# Altium project AccessControl.PrjPcb (part 2 of 2)

## Sheet UART_RS485.SchDoc: Access Control
size A; DrawnBy: Q.Thang & T.Khoa; Revision: V1.0.1; SheetNumber: 12; SheetTotal: 16
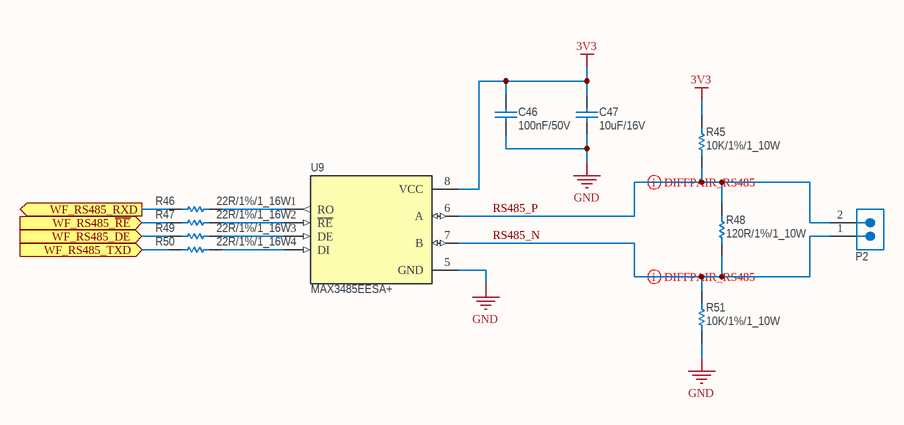
[diagram p7: UART_RS485.SchDoc]

### Parts
C46  100nF/50V  [CAP_0603]
C47  10uF/16V  [CAP_0603]
P2  3.81mm_2P  [Terminal_Block_3.81mm_2P]  (value not drawn)
R45  10K/1%/1_10W  [Resistor_0603]
R46  22R/1%/1_16W  [RESISTOR_0402]
R47  22R/1%/1_16W  [RESISTOR_0402]
R48  120R/1%/1_10W  [Resistor_0603]
R49  22R/1%/1_16W  [RESISTOR_0402]
R50  22R/1%/1_16W  [RESISTOR_0402]
R51  10K/1%/1_10W  [Resistor_0603]
U9  MAX3485EESA+  [SOIC-8]

### Ports
WF_RS485_DE (in, see Overview_Schematic[6B], ESP32_WiFi[3B]), WF_RS485_RXD (out, see Overview_Schematic[6B], ESP32_WiFi[3A]), WF_RS485_TXD (in, see Overview_Schematic[6B], ESP32_WiFi[3A]), WF_RS485_~{RE} (in, see Overview_Schematic[6B], ESP32_WiFi[3B])

### Nets
3V3: C46.2 C47.2 R45.2 U9.8(VCC)
GND: C46.1 C47.1 R51.2 U9.5(GND)
RS485_N: P2.1 R48.1 R51.1 U9.7(B)
RS485_P: P2.2 R45.1 R48.2 U9.6(A)
NetR46_1: R46.1 ; port WF_RS485_RXD
NetR46_2: R46.2 U9.1(RO)
NetR47_1: R47.1 ; port WF_RS485_~{RE}
NetR47_2: R47.2 U9.2(~{RE})
NetR49_1: R49.1 ; port WF_RS485_DE
NetR49_2: R49.2 U9.3(DE)
NetR50_1: R50.1 ; port WF_RS485_TXD
NetR50_2: R50.2 U9.4(DI)

### Layout directives
differential pair: RS485_N, RS485_P

### Notes on the sheet
- Project Name
- Size
- A4
- Revision
- Checked By:
- Drawn By:
- Date:
- File:
- Last Modified:
- Sheet
- of

### Library data of the parts
C46 = Ceramic_Cap_100nF_50V_0603: as C1 on sheet Power_Supply; Datasheet: *; Supply URL: https://www.thegioiic.com/tu-gom-0603-100nf-0-1uf-50v
C47 = Ceramic_Cap_10uF_16V_0603: as C83 on sheet DAC_ADC_External; Datasheet: *; Supply URL: https://www.thegioiic.com/tu-gom-0603-10uf-16v
P2 = Terminal_Block_3.81mm_2P: Terminal Block THT, pitch 3.81mm, 2p, 300V, 10A; Supply Part Number: UL-3.81-2-R Terminal Block Plug-in Hàn PCB 2 Chân Cong 3.81mm 300V 10A ULO; Supply Name: Thegioiic; Supply URL: https://www.thegioiic.com/ul-3-81-2-r-terminal-block-plug-in-han-pcb-2-chan-cong-3-81mm-300v-10a-ulo
R45 R51 = Res_10K_0603_1%: as R17 on sheet ESP32_BLE; Supply URL: https://www.thegioiic.com/dien-tro-10-kohm-0603-1-
R46 R47 R49 R50 = Res_22R_0402_1%: Resistor 0402 22 Ohm 1% 1_16W; Supply Name: *; Supply Part Number: *; Supply URL: *
R48 = Res_120R_0603_1%: Resistor 0603 120 Ohm 1% 1_10W; Supply Part Number: Điện Trở 120 Ohm 0603 1%; Supply Name: Thegioiic; Supply URL: https://www.thegioiic.com/dien-tro-120-ohm-0603-1-
U9 = MAX3485EESA+: 1/1 Transceiver Half RS422, RS485 8-SOIC; Supply Part Number: MAX3485EESA+ Line Transceiver, 8-SOIC; Supply Name: Thegioiic; Datasheet: https://www.analog.com/media/en/technical-documentation/data-sheets/max3483e-max3491e.pdf; Supply URL: https://www.thegioiic.com/max3485eesa-line-transceiver-8-soic

## Sheet Camera.SchDoc: Access Control
size A; DrawnBy: Q.Thang & T.Khoa; Revision: V1.0.1; SheetNumber: 9; SheetTotal: 16
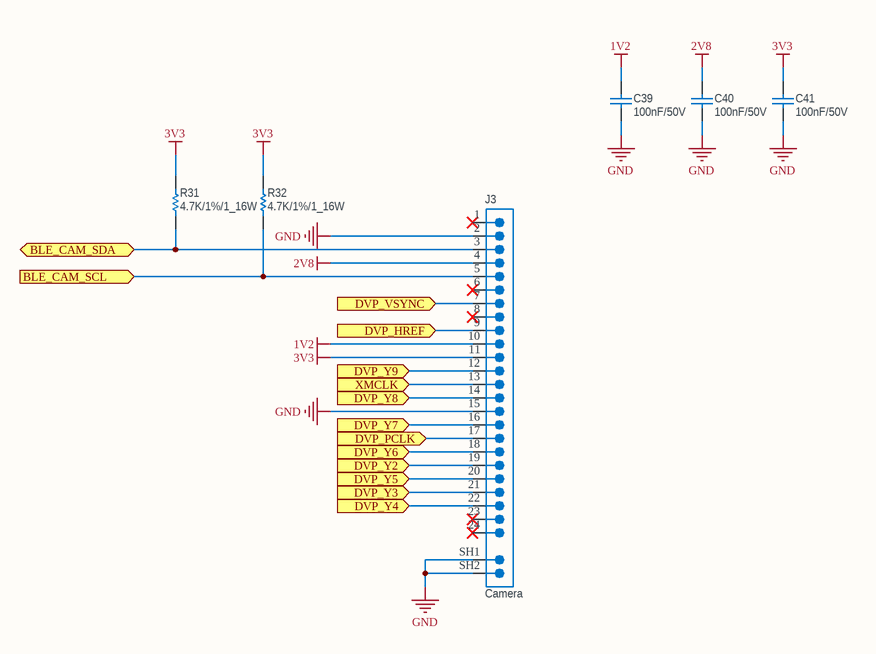
[diagram p8: Camera.SchDoc]

### Parts
C39  100nF/50V  [CAP_0402]
C40  100nF/50V  [CAP_0402]
C41  100nF/50V  [CAP_0402]
J3  Camera  [FPC_0.5mm_24P]
R31  4.7K/1%/1_16W  [RESISTOR_0402]
R32  4.7K/1%/1_16W  [RESISTOR_0402]

### Ports
BLE_CAM_SCL (in, see Overview_Schematic[3B], ESP32_BLE[3B]), BLE_CAM_SDA (bidir, see Overview_Schematic[3B], ESP32_BLE[2B]), DVP_HREF (in, see Overview_Schematic[3B], ESP32_BLE[3B]), DVP_PCLK (in, see Overview_Schematic[3B], ESP32_BLE[2B]), DVP_VSYNC (in, see Overview_Schematic[3B], ESP32_BLE[2B]), DVP_Y2 (in, see Overview_Schematic[3B], ESP32_BLE[3A]), DVP_Y3 (in, see Overview_Schematic[3B], ESP32_BLE[2B]), DVP_Y4 (in, see Overview_Schematic[3B], ESP32_BLE[2B]), DVP_Y5 (in, see Overview_Schematic[3B], ESP32_BLE[3A]), DVP_Y6 (in, see Overview_Schematic[3B], ESP32_BLE[3B]), DVP_Y7 (in, see Overview_Schematic[3B], ESP32_BLE[2B]), DVP_Y8 (in, see Overview_Schematic[3B], ESP32_BLE[2B]), DVP_Y9 (in, see Overview_Schematic[3B], ESP32_BLE[2B]), XMCLK (in, see Overview_Schematic[3B], ESP32_BLE[2B])

### Nets
1V2: C39.2 J3.10
2V8: C40.2 J3.4
3V3: C41.2 J3.11 R31.2 R32.2
GND: C39.1 C40.1 C41.1 J3.2 J3.15 J3.SH1(SHIELD) J3.SH2(SHIELD)
NetJ3_3: J3.3 R31.1 ; port BLE_CAM_SDA
NetJ3_5: J3.5 R32.1 ; port BLE_CAM_SCL
NetJ3_7: J3.7 ; port DVP_VSYNC
NetJ3_9: J3.9 ; port DVP_HREF
NetJ3_12: J3.12 ; port DVP_Y9
NetJ3_13: J3.13 ; port XMCLK
NetJ3_14: J3.14 ; port DVP_Y8
NetJ3_16: J3.16 ; port DVP_Y7
NetJ3_17: J3.17 ; port DVP_PCLK
NetJ3_18: J3.18 ; port DVP_Y6
NetJ3_19: J3.19 ; port DVP_Y2
NetJ3_20: J3.20 ; port DVP_Y5
NetJ3_21: J3.21 ; port DVP_Y3
NetJ3_22: J3.22 ; port DVP_Y4

Not connected (* = marked no-connect by the designer): J3 1* 6* 8* 23* 24*

### Notes on the sheet
- Project Name
- Size
- A4
- Revision
- Checked By:
- Drawn By:
- Date:
- File:
- Last Modified:
- Sheet
- of

### Library data of the parts
C39-C41 = Ceramic_Cap_100nF_50V_0402: CAP, size 0402, 100nF, 50V; Supply Part Number: Tụ Gốm 0402 100nF (0.1uF) 50V; Supply Name: Thegioiic; Datasheet: *; Supply URL: https://www.thegioiic.com/tu-gom-0402-100nf-0-1uf-50v
J3 = FPC_0.5mm_24P: Cổng FPC 24 Chân 0.5mm Tiếp Điểm Trên, 0.4A 50V; Supply Name: Thegioiic; Supply Part Number: Cổng FPC 24 Chân 0.5mm Tiếp Điểm Trên; Supply URL: https://www.thegioiic.com/cong-fpc-24-chan-0-5mm-tiep-diem-tren
R31 R32 = Res_4.7K_0402_1%: Resistor 0402 4.7KOhm 1% 1_16W; Supply Part Number: Điện Trở 4.7 KOhm 0402 1%; Supply Name: Thegioiic; Supply URL: https://www.thegioiic.com/dien-tro-4-7-kohm-0402-1-

## Sheet Display.SchDoc: Access Control
size A; DrawnBy: Q.Thang & T.Khoa; Revision: V1.0.1; SheetNumber: 10; SheetTotal: 16
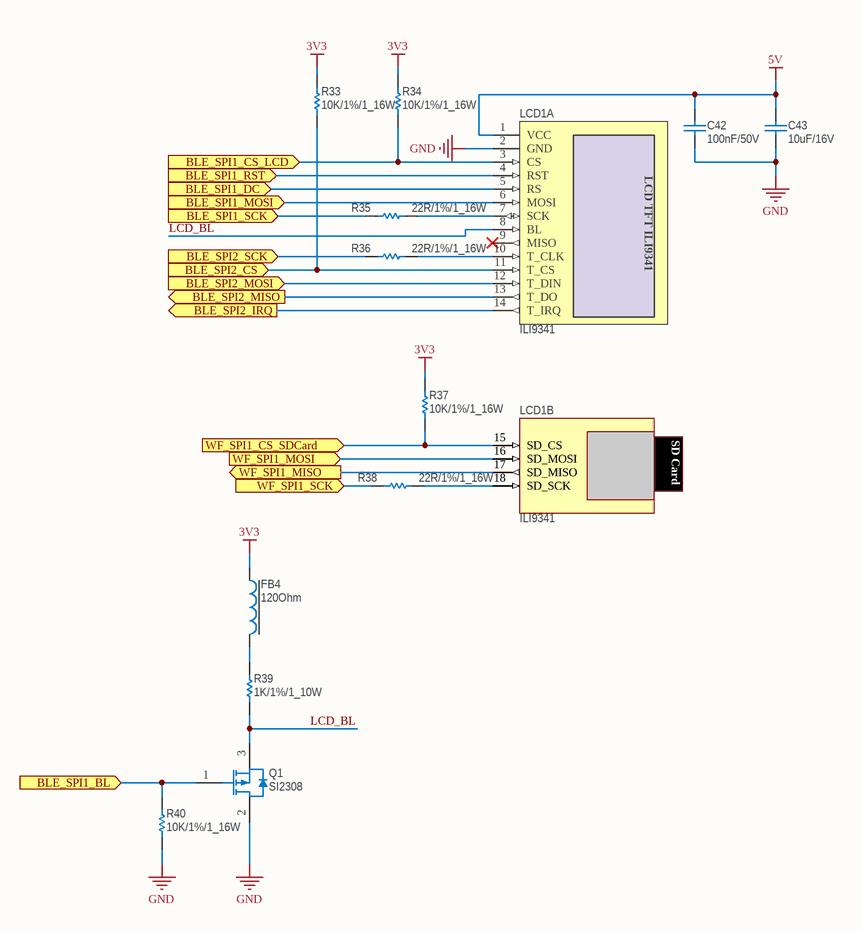
[diagram p9: Display.SchDoc]

### Parts
C42  100nF/50V  [CAP_0603]
C43  10uF/16V  [CAP_0603]
FB4  120Ohm  [Ferrite_Bead_0805]
LCD1  ILI9341  [LCD_TFT_ILI9341_3.2]  (parts A,B of 2)
Q1  SI2308  [SOT-23]
R33  10K/1%/1_16W  [RESISTOR_0402]
R34  10K/1%/1_16W  [RESISTOR_0402]
R35  22R/1%/1_16W  [RESISTOR_0402]
R36  22R/1%/1_16W  [RESISTOR_0402]
R37  10K/1%/1_16W  [RESISTOR_0402]
R38  22R/1%/1_16W  [RESISTOR_0402]
R39  1K/1%/1_10W  [Resistor_0603]
R40  10K/1%/1_16W  [RESISTOR_0402]

### Ports
BLE_SPI1_BL (in, see Overview_Schematic[4C], ESP32_BLE[3B]), BLE_SPI1_CS_LCD (in, see Overview_Schematic[3C], ESP32_BLE[4B]), BLE_SPI1_DC (in, see Overview_Schematic[3C], ESP32_BLE[3B]), BLE_SPI1_MOSI (in, see Overview_Schematic[3C], ESP32_BLE[3B]), BLE_SPI1_RST (in, see Overview_Schematic[3C], ESP32_BLE[2B]), BLE_SPI1_SCK (in, see Overview_Schematic[3C], ESP32_BLE[3B]), BLE_SPI2_CS (in, see Overview_Schematic[3C], ESP32_BLE[3B]), BLE_SPI2_IRQ (out, see Overview_Schematic[3C], ESP32_BLE[3B]), BLE_SPI2_MISO (out, see Overview_Schematic[3C], ESP32_BLE[3B]), BLE_SPI2_MOSI (in, see Overview_Schematic[3C], ESP32_BLE[3B]), BLE_SPI2_SCK (in, see Overview_Schematic[3C], ESP32_BLE[4B]), WF_SPI1_CS_SDCard (in, see Overview_Schematic[5C], ESP32_WiFi[3B]), WF_SPI1_MISO (out, see Overview_Schematic[5C], ESP32_WiFi[2B]), WF_SPI1_MOSI (in, see Overview_Schematic[5C], DAC_ADC_External[1C], ESP32_WiFi[2B]), WF_SPI1_SCK (in, see Overview_Schematic[5C], DAC_ADC_External[1C], ESP32_WiFi[2B])

### Nets
3V3: FB4.1 R33.2 R34.2 R37.2
5V: C42.2 C43.2 LCD1.1(VCC)
GND: C42.1 C43.1 LCD1.2(GND) Q1.2(SOURCE) R40.1
LCD_BL: LCD1.8(BL) Q1.3(DRAIN) R39.1
NetFB4_2: FB4.2 R39.2
NetLCD1_3: LCD1.3(CS) R34.1 ; port BLE_SPI1_CS_LCD
NetLCD1_4: LCD1.4(RST) ; port BLE_SPI1_RST
NetLCD1_5: LCD1.5(RS) ; port BLE_SPI1_DC
NetLCD1_6: LCD1.6(MOSI) ; port BLE_SPI1_MOSI
NetLCD1_7: LCD1.7(SCK) R35.2
NetLCD1_10: LCD1.10(T_CLK) R36.2
NetLCD1_11: LCD1.11(T_CS) R33.1 ; port BLE_SPI2_CS
NetLCD1_12: LCD1.12(T_DIN) ; port BLE_SPI2_MOSI
NetLCD1_13: LCD1.13(T_DO) ; port BLE_SPI2_MISO
NetLCD1_14: LCD1.14(T_IRQ) ; port BLE_SPI2_IRQ
NetLCD1_15: LCD1.15(SD_CS) R37.1 ; port WF_SPI1_CS_SDCard
NetLCD1_16: LCD1.16(SD_MOSI) ; port WF_SPI1_MOSI
NetLCD1_17: LCD1.17(SD_MISO) ; port WF_SPI1_MISO
NetLCD1_18: LCD1.18(SD_SCK) R38.2
NetQ1_1: Q1.1(GATE) R40.2 ; port BLE_SPI1_BL
NetR19_2: R36.1 ; port BLE_SPI2_SCK
NetR35_1: R35.1 ; port BLE_SPI1_SCK
NetR38_1: R38.1 ; port WF_SPI1_SCK

Not connected (* = marked no-connect by the designer): LCD1 9(MISO)*

### Notes on the sheet
- Project Name
- Size
- A4
- Revision
- Checked By:
- Drawn By:
- Date:
- File:
- Last Modified:
- Sheet
- of
- (in symbol LCD TFT, part A) LCD TFT ILI9341
- (in symbol LCD TFT, part B) SD Card

### Library data of the parts
C42 = Ceramic_Cap_100nF_50V_0603: as C1 on sheet Power_Supply; Datasheet: *; Supply URL: https://www.thegioiic.com/tu-gom-0603-100nf-0-1uf-50v
C43 = Ceramic_Cap_10uF_16V_0603: as C83 on sheet DAC_ADC_External; Datasheet: *; Supply URL: https://www.thegioiic.com/tu-gom-0603-10uf-16v
FB4 = Ferrite_Bead_120Ohm_2A_0805: Ferrite Bead, size 0805, 120Ohm, 2A; Supply Part Number: CBW201209U121T Ferrite Beads 2A 120 Ohm 0805; Supply Name: Thegioiic; Supply URL: https://www.thegioiic.com/cbw201209u121t-ferrite-beads-2a-120-ohm-0805
LCD1 = LCD TFT: Supply Part Number: LCD 3.2inch 320x240 TFT ILI9341 Cảm Ứng Điện Trở SPI; Supply Name: Thegioiic; Supply URL: https://www.thegioiic.com/lcd-3-2inch-320x240-tft-ili9341-cam-ung-dien-tro-spi
Q1 = SI2308: SI2308 SOT23 MOSFET N-CH 2A 60V; Supply Name: BanLinhKien; Datasheet: https://www.mouser.vn/datasheet/2/427/si2308bd-1765649.pdf; Supply Part Number: SI2308 SOT23 MOSFET N-CH 2A 60V; Supply URL: https://banlinhkien.com/si2308-sot23-mosfet-nch-2a-60v-smda8s-5c-p15289840.html
R33 R34 R37 R40 = Res_10K_0402_1%: as R21 on sheet ESP32_BLE; Supply URL: https://www.thegioiic.com/dien-tro-10-kohm-0402-1-
R35 R36 R38 = Res_22R_0402_1%: Resistor 0402 22 Ohm 1% 1_16W; Supply Name: *; Supply Part Number: *; Supply URL: *
R39 = Res_1K_0603_1%: Resistor 0603 1KOhm 1% 1_10W; Supply Part Number: Điện Trở 1 KOhm 0603 1%; Supply Name: Thegioiic; Supply URL: https://www.thegioiic.com/dien-tro-1-kohm-0603-1-

## Sheet Interface_IO.SchDoc: Access Control
size A3; DrawnBy: Q.Thang & T.Khoa; Revision: V1.0.1; SheetNumber: 16; SheetTotal: 16
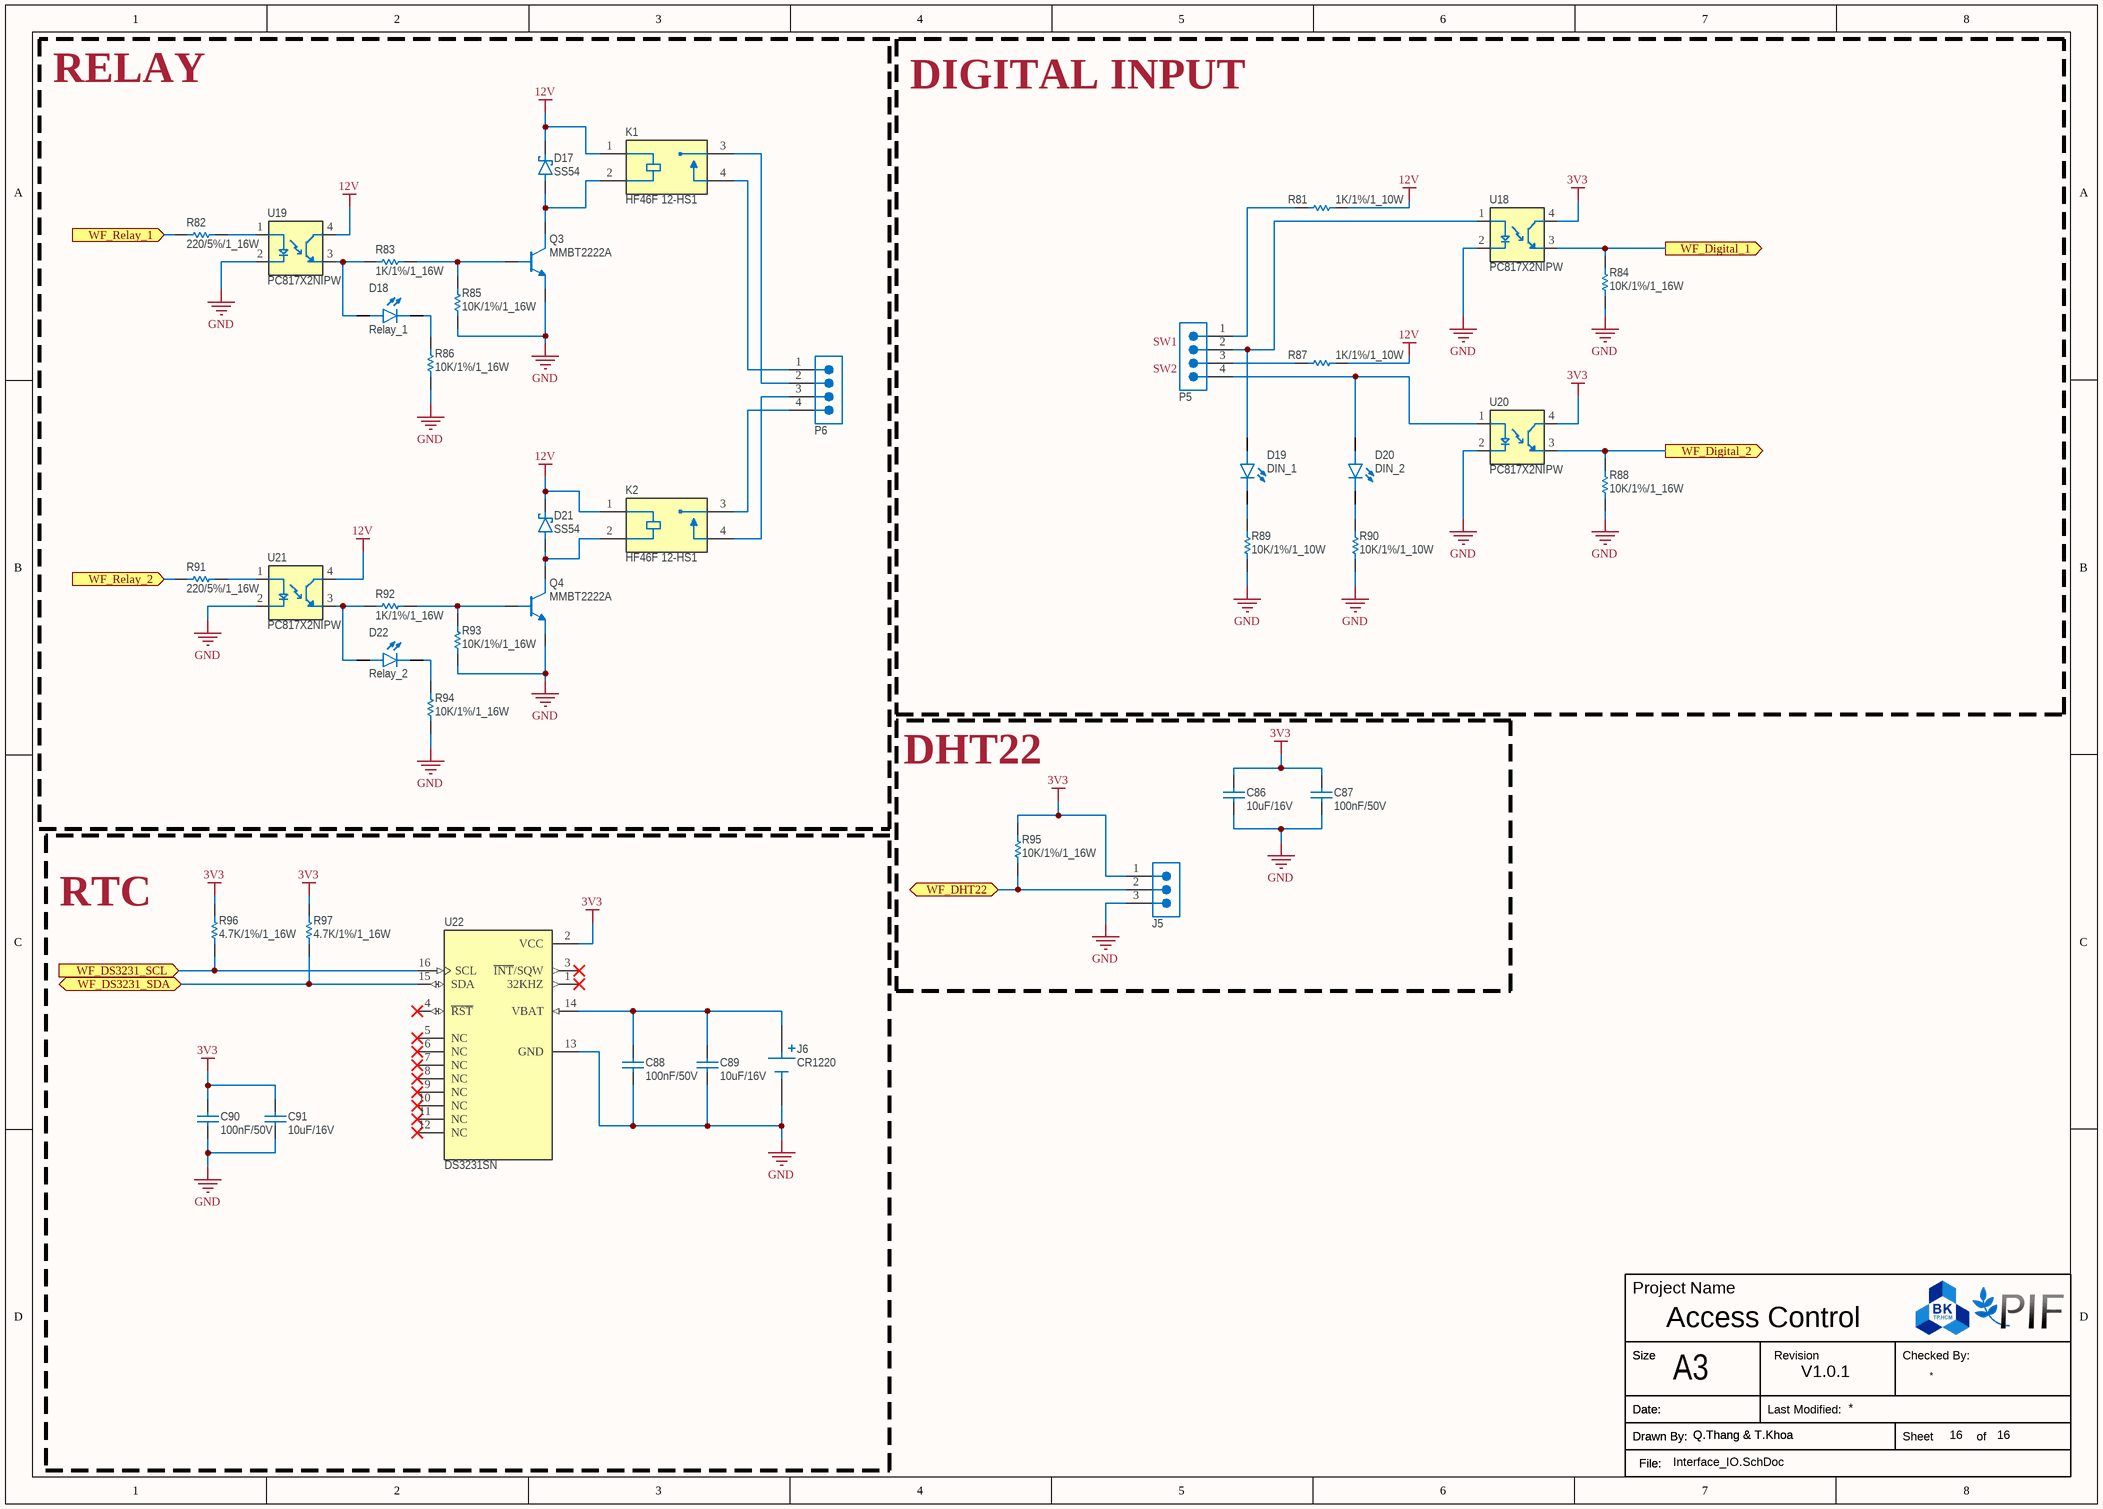
[diagram p10: Interface_IO.SchDoc]

### Parts
C86  10uF/16V  [CAP_0603]
C87  100nF/50V  [CAP_0603]
C88  100nF/50V  [CAP_0603]
C89  10uF/16V  [CAP_0603]
C90  100nF/50V  [CAP_0603]
C91  10uF/16V  [CAP_0603]
D17  SS54  [D_SMA]
D18  Relay_1  [LED_0603Y]
D19  DIN_1  [LED_0603Y]
D20  DIN_2  [LED_0603Y]
D21  SS54  [D_SMA]
D22  Relay_2  [LED_0603Y]
J5  3.81mm_3P  [Terminal_Block_3.81mm_3P]  (value not drawn)
J6  CR1220  [Battery_Holder_CR1220]
K1  HF46F 12-HS1  [RELAY_HF46F_005-HS1]
K2  HF46F 12-HS1  [RELAY_HF46F_005-HS1]
P5  3.81mm_4P  [Terminal_Block_3.81mm_4P]  (value not drawn)
P6  3.81mm_4P  [Terminal_Block_3.81mm_4P]  (value not drawn)
Q3  MMBT2222A  [SOT-23]
Q4  MMBT2222A  [SOT-23]
R81  1K/1%/1_10W  [Resistor_0603]
R82  220/5%/1_16W  [RESISTOR_0402]
R83  1K/1%/1_16W  [RESISTOR_0402]
R84  10K/1%/1_16W  [RESISTOR_0402]
R85  10K/1%/1_16W  [RESISTOR_0402]
R86  10K/1%/1_16W  [RESISTOR_0402]
R87  1K/1%/1_10W  [Resistor_0603]
R88  10K/1%/1_16W  [RESISTOR_0402]
R89  10K/1%/1_10W  [Resistor_0603]
R90  10K/1%/1_10W  [Resistor_0603]
R91  220/5%/1_16W  [RESISTOR_0402]
R92  1K/1%/1_16W  [RESISTOR_0402]
R93  10K/1%/1_16W  [RESISTOR_0402]
R94  10K/1%/1_16W  [RESISTOR_0402]
R95  10K/1%/1_16W  [RESISTOR_0402]
R96  4.7K/1%/1_16W  [RESISTOR_0402]
R97  4.7K/1%/1_16W  [RESISTOR_0402]
U18  PC817X2NIPW  [SOP-4]
U19  PC817X2NIPW  [SOP-4]
U20  PC817X2NIPW  [SOP-4]
U21  PC817X2NIPW  [SOP-4]
U22  DS3231SN  [SOIC-16]

### Blocks framed on the sheet
RELAY: D17 D18 D21 D22 K1 K2 P6 Q3 Q4 R82 R83 R85 R86 R91-R94 U19 U21
DIGITAL INPUT: D19 D20 P5 R81 R84 R87-R90 U18 U20
DHT22: C86 C87 J5 R95
RTC: C88-C91 J6 R96 R97 U22

### Ports
WF_DHT22 (bidir, see Overview_Schematic[6B], ESP32_WiFi[2B]), WF_Digital_1 (out, see Overview_Schematic[6B], ESP32_WiFi[2B]), WF_Digital_2 (out, see Overview_Schematic[6B], ESP32_WiFi[2B]), WF_DS3231_SCL (in, see Overview_Schematic[6B], ESP32_WiFi[3B]), WF_DS3231_SDA (bidir, see Overview_Schematic[6B], ESP32_WiFi[3B]), WF_Relay_1 (in, see Overview_Schematic[6B], ESP32_WiFi[2B]), WF_Relay_2 (in, see Overview_Schematic[6B], ESP32_WiFi[2B])

### Nets
3V3: C86.2 C87.2 C90.2 C91.2 J5.1 R95.2 R96.2 R97.2 U18.4(CT) U20.4(CT) U22.2(VCC)
12V: D17.1(C) D21.1(C) K1.1(COIL1) K2.1(COIL1) R81.1 R87.1 U19.4(CT) U21.4(CT)
GND: C86.1 C87.1 C88.1 C89.1 C90.1 C91.1 J5.3 J6.N(NEG) Q3.2(E) Q4.2(E) R84.1 R85.1 R86.1 R88.1 R89.1 R90.1 R93.1 R94.1 U18.2(C) U19.2(C) U20.2(C) U21.2(C) U22.13(GND)
NetC88_2: C88.2 C89.2 J6.P(POS) U22.14(VBAT)
NetD17_2: D17.2(A) K1.2(COIL2) Q3.3(C)
NetD18_A: D18.A R83.1 U19.3(ET)
NetD18_C: D18.C R86.2
NetD19_A: D19.A P5.2 U18.1(A)
NetD19_C: D19.C R89.2
NetD20_A: D20.A P5.4 U20.1(A)
NetD20_C: D20.C R90.2
NetD21_2: D21.2(A) K2.2(COIL2) Q4.3(C)
NetD22_A: D22.A R92.1 U21.3(ET)
NetD22_C: D22.C R94.2
NetJ5_2: J5.2 R95.1 ; port WF_DHT22
NetK1_3: K1.3(COM) P6.2
NetK1_4: K1.4(NO) P6.1
NetK2_3: K2.3(COM) P6.4
NetK2_4: K2.4(NO) P6.3
NetP5_1: P5.1 R81.2
NetP5_3: P5.3 R87.2
NetQ3_1: Q3.1(B) R83.2 R85.2
NetQ4_1: Q4.1(B) R92.2 R93.2
NetR82_1: R82.1 ; port WF_Relay_1
NetR82_2: R82.2 U19.1(A)
NetR84_2: R84.2 U18.3(ET) ; port WF_Digital_1
NetR88_2: R88.2 U20.3(ET) ; port WF_Digital_2
NetR91_1: R91.1 ; port WF_Relay_2
NetR91_2: R91.2 U21.1(A)
NetR96_1: R96.1 U22.16(SCL) ; port WF_DS3231_SCL
NetR97_1: R97.1 U22.15(SDA) ; port WF_DS3231_SDA

Not connected (* = marked no-connect by the designer): U22 1(32KHZ)* 3(~{INT}/SQW)* 4(~{RST})* 5(NC)* 6(NC)* 7(NC)* 8(NC)* 9(NC)* 10(NC)* 11(NC)* 12(NC)*

### Notes on the sheet
- (near P5) SW1
- (near P5) SW2
- Project Name
- Size
- A3
- Revision
- Checked By:
- Drawn By:
- Date:
- File:
- Last Modified:
- Sheet
- of

### Library data of the parts
C86 C89 C91 = Ceramic_Cap_10uF_16V_0603: CAP, size 0603, 10uF, 16V; Supply Part Number: Tụ Gốm 0603 10uF 16V; Supply Name: Thegioiic; Datasheet: *; Supply URL: https://www.thegioiic.com/tu-gom-0603-10uf-16v
C87 C88 C90 = Ceramic_Cap_100nF_50V_0603: CAP, size 0603, 100nF, 50V; Supply Part Number: Tụ Gốm 0603 100nF (0.1uF) 50V; Supply Name: Thegioiic; Datasheet: *; Supply URL: https://www.thegioiic.com/tu-gom-0603-100nf-0-1uf-50v
D17 D21 = Diode_SS54: Diode Schottky 40V 5A Surface Mount SMA; Supply Part Number: SS54 SMA Diode Shotky 5A 40V; Supply Name: Thegioiic; Datasheet: https://www.thegioiic.com/upload/documents/dc8a63b3eda4738bc390d9dc570a4e18.pdf; Supply URL: https://www.thegioiic.com/ss54-sma-diode-shotky-5a-40v
D18-D20 D22 = LED_Yellow_0603: LED Yellow 0603; Supply Part Number: LED Vàng 0603 Dán SMD Trong Suốt Harvatek; Supply Name: Thegioiic; Supply URL: https://www.thegioiic.com/led-vang-0603-dan-smd-trong-suot-harvatek
J5 = Terminal_Block_3.81mm_3P: Terminal Block THT, pitch 3.81mm, 3p, 300V 10A; Supply Part Number: UL-3.81-3-R Terminal Block Plug-in Hàn PCB 3 Chân Cong 3.81mm 300V 10A ULO; Supply Name: Thegioiic; Datasheet: *; Supply URL: https://www.thegioiic.com/ul-3-81-3-r-terminal-block-plug-in-han-pcb-3-chan-cong-3-81mm-300v-10a-ulo
J6 = Battery_Holder_CR1220: Coin Cell Battery Retainer, Horizontal SMT, for CR1220 Coin Cell Batteries, Tape & Reeled; Supply Part Number: Đế Pin CR1220 Dán SMD; Supply Name: Thegioiic; Datasheet: *; Supply URL: https://www.thegioiic.com/de-pin-cr1220-dan-smd
K1 K2 = HF46F 12-HS1: 4 chân xuyên lỗ; Supply Part Number: HF46F 12-HS1 Rơ Le 12VDC 5A SPST-NO 4 Chân; Supply Name: Thegioiic; Datasheet: https://www.thegioiic.com/upload/documents/1734591411_HF-Xiamen-Hongfa-Electroacoustic-HF46F.pdf; Supply URL: https://www.thegioiic.com/hf46f-12-hs1-ro-le-12vdc-5a-spst-no-4-chan
P5 P6 = Terminal_Block_3.81mm_4P: Terminal Block THT, pitch 3.81mm, 4p, 300V 10A; Supply Part Number: UL-3.81-4-R Terminal Block Plug-in Hàn PCB 4 Chân Cong 3.81mm 300V 10A ULO; Supply Name: Thegioiic; ComponentLink1Description: Website Link; ComponentLink1URL: https://www.we-online.com/redexpert/article/691322310004?ad; ComponentLink2Description: Datasheet Link; ComponentLink2URL: https://www.we-online.com/redexpert/spec/691322310004?ad; Supply URL: https://www.thegioiic.com/ul-3-81-4-r-terminal-block-plug-in-han-pcb-4-chan-cong-3-81mm-300v-10a-ulo
Q3 Q4 = MMBT2222A: Điện áp Vce max: 40V, dòng Ic max: 0.6A, công suất: 0.3W; Supply Part Number: MMBT2222A 1P Transistor NPN 40V 0.6A 3 Chân SOT-23; Supply Name: Thegioiic; Datasheet: https://www.thegioiic.com/upload/documents/1734592311_MMBT2222A.pdf; Supply URL: https://www.thegioiic.com/mmbt2222a-1p-transistor-npn-40v-0-6a-3-chan-sot-23
R81 R87 = Res_1K_0603_1%: Resistor 0603 1KOhm 1% 1_10W; Supply Part Number: Điện Trở 1 KOhm 0603 1%; Supply Name: Thegioiic; Supply URL: https://www.thegioiic.com/dien-tro-1-kohm-0603-1-
R82 R91 = Res_220R_0402_5%: Resistor 0402 220 Ohm 5% 1_16W; Supply Part Number: Điện Trở 220 Ohm 0402 5%; Supply Name: Thegioiic; Supply URL: https://www.thegioiic.com/dien-tro-220-ohm-0402-5-
R83 R92 = Res_1K_0402_1%: Resistor 0402 1KOhm 1% 1_16W; Supply Part Number: Điện Trở 1 KOhm 0402 1%; Supply Name: Thegioiic; Supply URL: https://www.thegioiic.com/dien-tro-1-kohm-0402-1-
R84-R86 R88 R93-R95 = Res_10K_0402_1%: Resistor 0402 10KOhm 1% 1_16W; Supply Part Number: Điện Trở 10 KOhm 0402 1%; Supply Name: Thegioiic; Supply URL: https://www.thegioiic.com/dien-tro-10-kohm-0402-1-
R89 R90 = Res_10K_0603_1%: Resistor 0603 10KOhm 1% 1_10W; Supply Part Number: Điện Trở 10 KOhm 0603 1%; Supply Name: Thegioiic; Supply URL: https://www.thegioiic.com/dien-tro-10-kohm-0603-1-
R96 R97 = Res_4.7K_0402_1%: Resistor 0402 4.7KOhm 1% 1_16W; Supply Part Number: Điện Trở 4.7 KOhm 0402 1%; Supply Name: Thegioiic; Supply URL: https://www.thegioiic.com/dien-tro-4-7-kohm-0402-1-
U18-U21 = PC817X2NIPW: Optocoupler DC-IN 1-CH Transistor DC-OUT 4-Pin; Supply Part Number: PC817X2NIPW Optoisolator Transistor Output 5000Vrms 1 Channel, SOP-4; Supply Name: Thegioiic; Datasheet: https://www.alldatasheet.com/datasheet-pdf/view/525168/SHARP/PC817X2NIP0F.html; Supply URL: https://www.thegioiic.com/pc817x2nipw-optoisolator-transistor-output-5000vrms-1-channel-sop-4
U22 = DS3231SN: Real Time Clock (RTC) IC Clock/Calendar - I²C, 2-Wire Serial 16-SOIC (0.295, 7.50mm Width); Supply Part Number: DS3231SN#T&R IC RTC Clock/Calendar; Supply Name: Thegioiic; Datasheet: https://www.mouser.com/datasheet/2/256/DS3231-102175.pdf; Supply URL: https://www.thegioiic.com/ds3231sn-t-r-ic-rtc-clock-calendar-16-sop

## Sheet FingerPrint.SchDoc: Access Control
size A; DrawnBy: Q.Thang & T.Khoa; Revision: V1.0.1; SheetNumber: 11; SheetTotal: 16
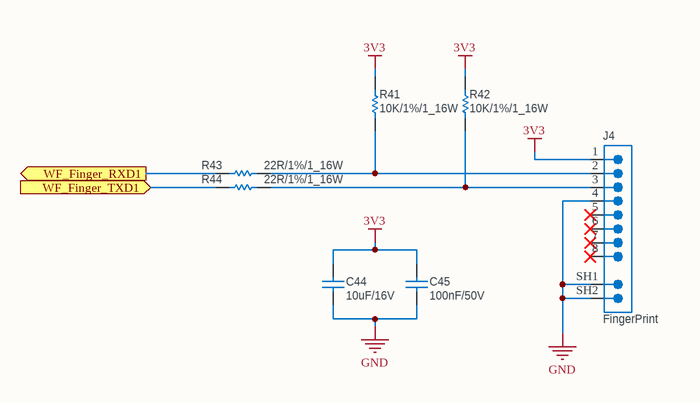
[diagram p11: FingerPrint.SchDoc]

### Parts
C44  10uF/16V  [CAP_0603]
C45  100nF/50V  [CAP_0603]
J4  FingerPrint  [MX_1.25mm_8P]
R41  10K/1%/1_16W  [RESISTOR_0402]
R42  10K/1%/1_16W  [RESISTOR_0402]
R43  22R/1%/1_16W  [RESISTOR_0402]
R44  22R/1%/1_16W  [RESISTOR_0402]

### Ports
WF_Finger_RXD1 (out, see Overview_Schematic[6B], ESP32_WiFi[3A]), WF_Finger_TXD1 (in, see Overview_Schematic[6A], ESP32_WiFi[3A])

### Nets
3V3: C44.2 C45.2 J4.1 R41.2 R42.2
GND: C44.1 C45.1 J4.4 J4.SH1(SHIELD) J4.SH2(SHIELD)
NetJ4_2: J4.2 R41.1 R43.2
NetJ4_3: J4.3 R42.1 R44.2
NetR43_1: R43.1 ; port WF_Finger_RXD1
NetR44_1: R44.1 ; port WF_Finger_TXD1

Not connected (* = marked no-connect by the designer): J4 5* 6* 7* 8*

### Notes on the sheet
- Project Name
- Size
- A4
- Revision
- Checked By:
- Drawn By:
- Date:
- File:
- Last Modified:
- Sheet
- of

### Library data of the parts
C44 = Ceramic_Cap_10uF_16V_0603: as C86 on sheet Interface_IO; Datasheet: *; Supply URL: https://www.thegioiic.com/tu-gom-0603-10uf-16v
C45 = Ceramic_Cap_100nF_50V_0603: as C87 on sheet Interface_IO; Datasheet: *; Supply URL: https://www.thegioiic.com/tu-gom-0603-100nf-0-1uf-50v
J4 = MX_1.25mm_8P: Đầu MX1.25mm 8 Chân Dán SMD Thẳng Đứng; Supply Name: Thegioiic; Supply Part Number: Đầu MX1.25mm 8 Chân Dán SMD Thẳng Đứng; Supply URL: https://www.thegioiic.com/dau-mx1-25mm-8-chan-dan-smd-thang-dung
R41 R42 = Res_10K_0402_1%: as R84-R86 on sheet Interface_IO; Supply URL: https://www.thegioiic.com/dien-tro-10-kohm-0402-1-
R43 R44 = Res_22R_0402_1%: Resistor 0402 22 Ohm 1% 1_16W; Supply Name: *; Supply Part Number: *; Supply URL: *

## Sheet Block_Diagram.SchDoc: Access Control
size A3; DrawnBy: Q.Thang & T.Khoa; Revision: V1.0.1; SheetNumber: 2; SheetTotal: 16

### Notes on the sheet
- Project Name
- Size
- A3
- Revision
- Checked By:
- Drawn By:
- Date:
- File:
- Last Modified:
- Sheet
- of
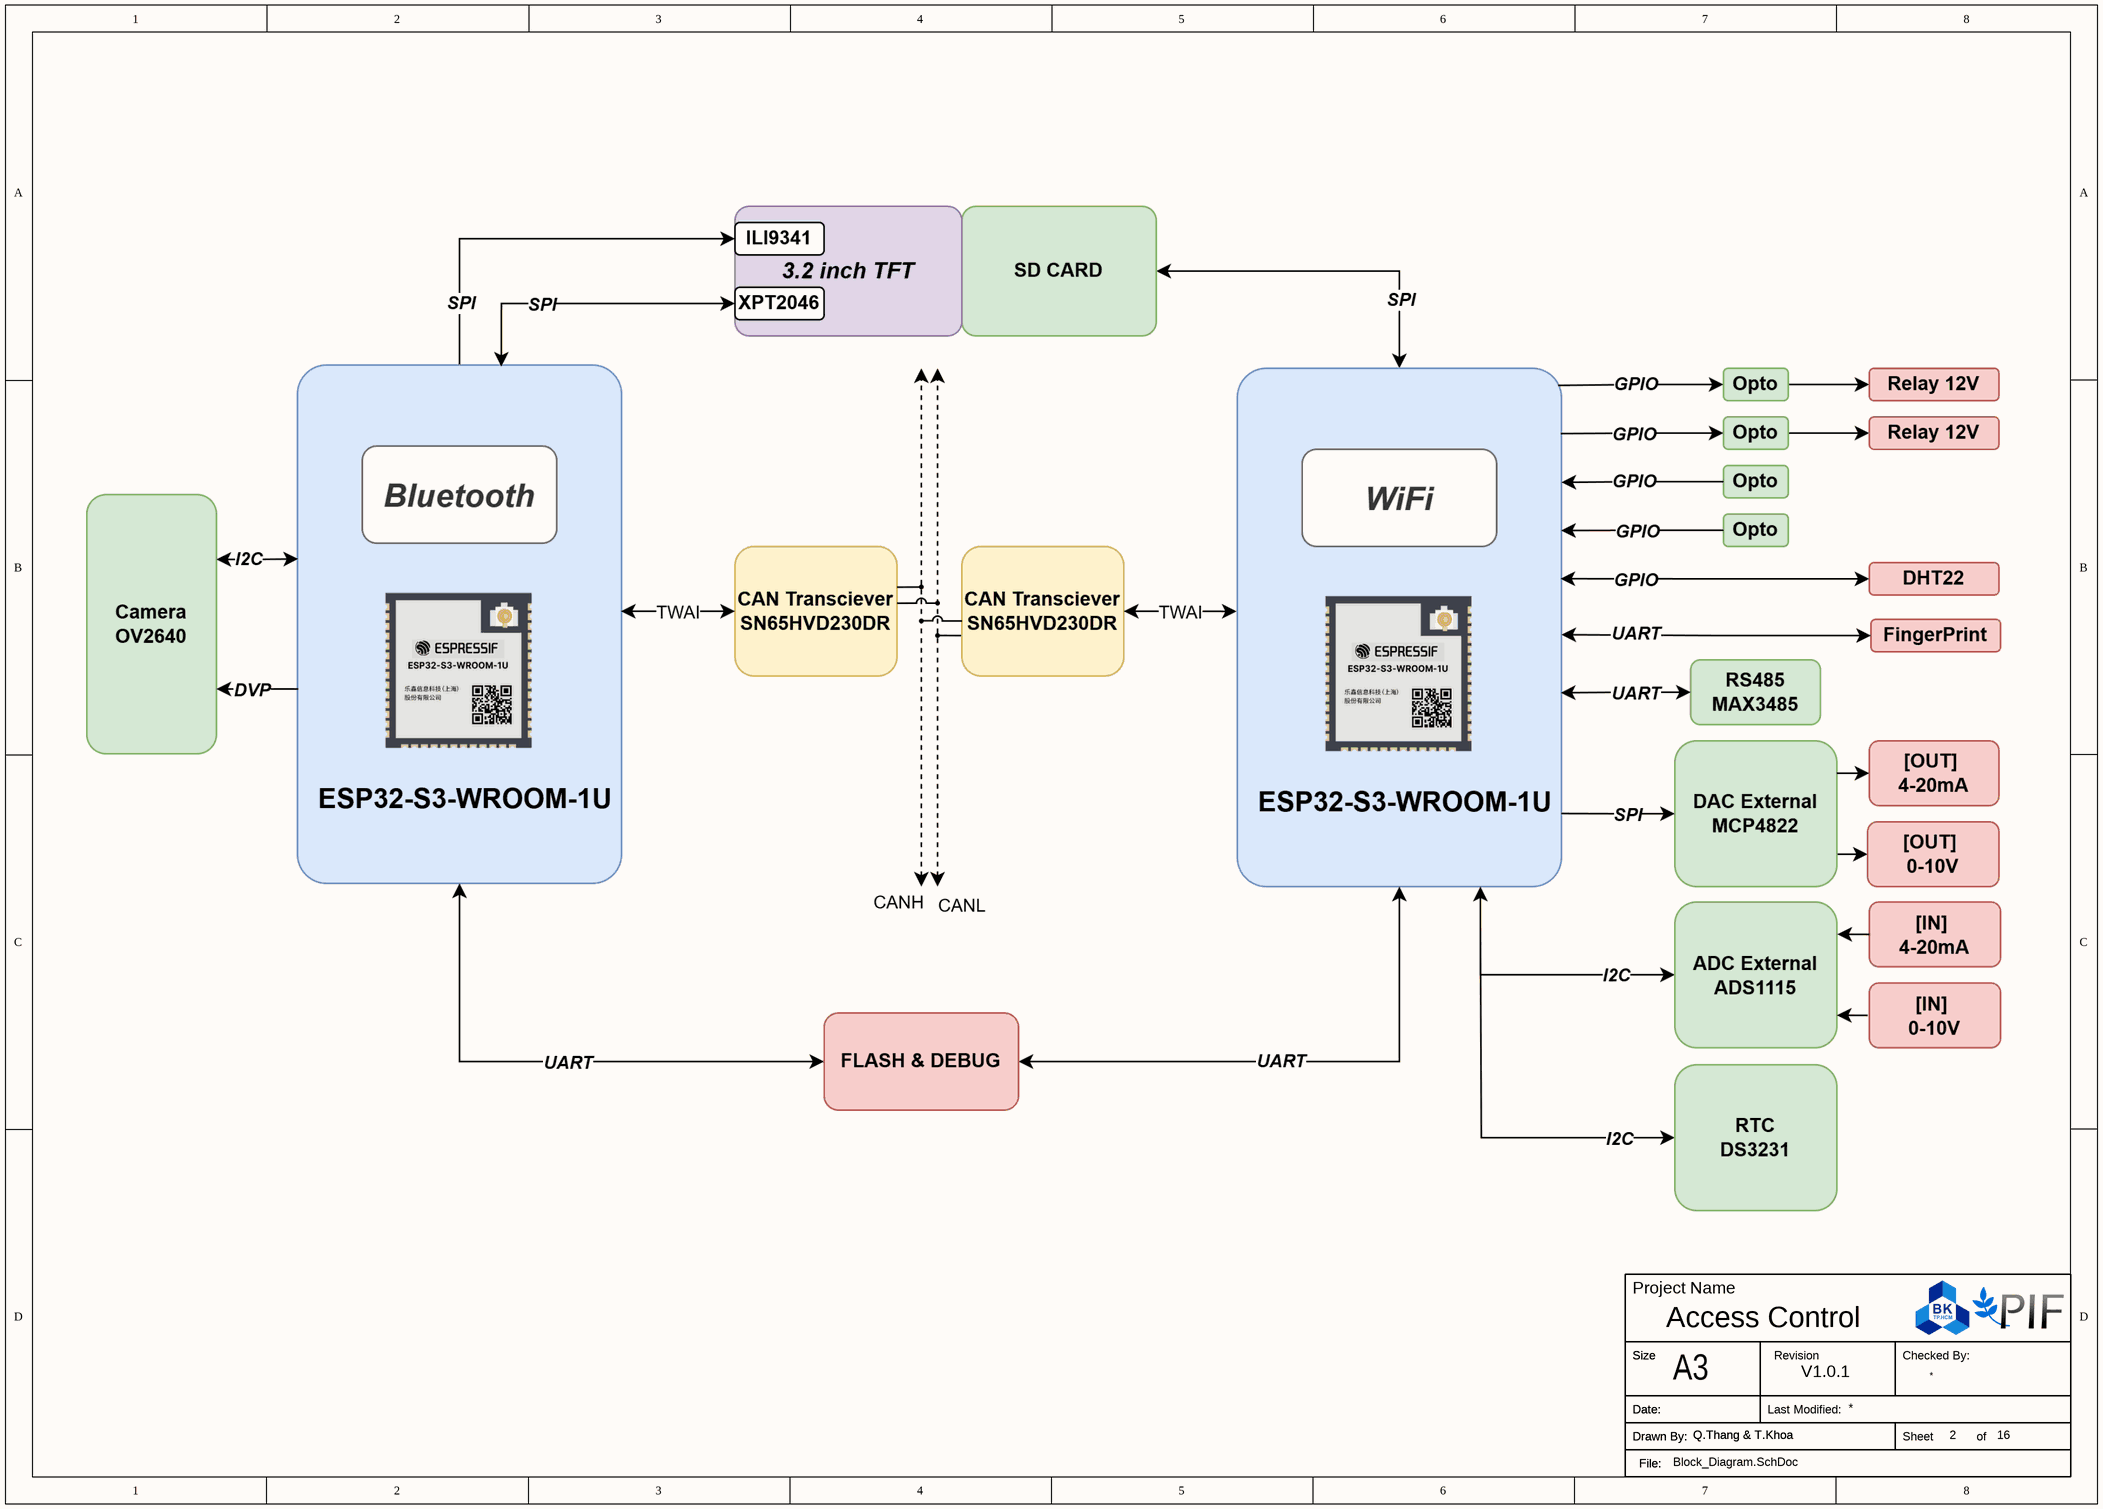
[diagram p12: Block_Diagram.SchDoc]

## Sheet Index.SchDoc: Access Control
size A; DrawnBy: Q.Thang & T.Khoa; Revision: V1.0.1; SheetNumber: 2; SheetTotal: 16
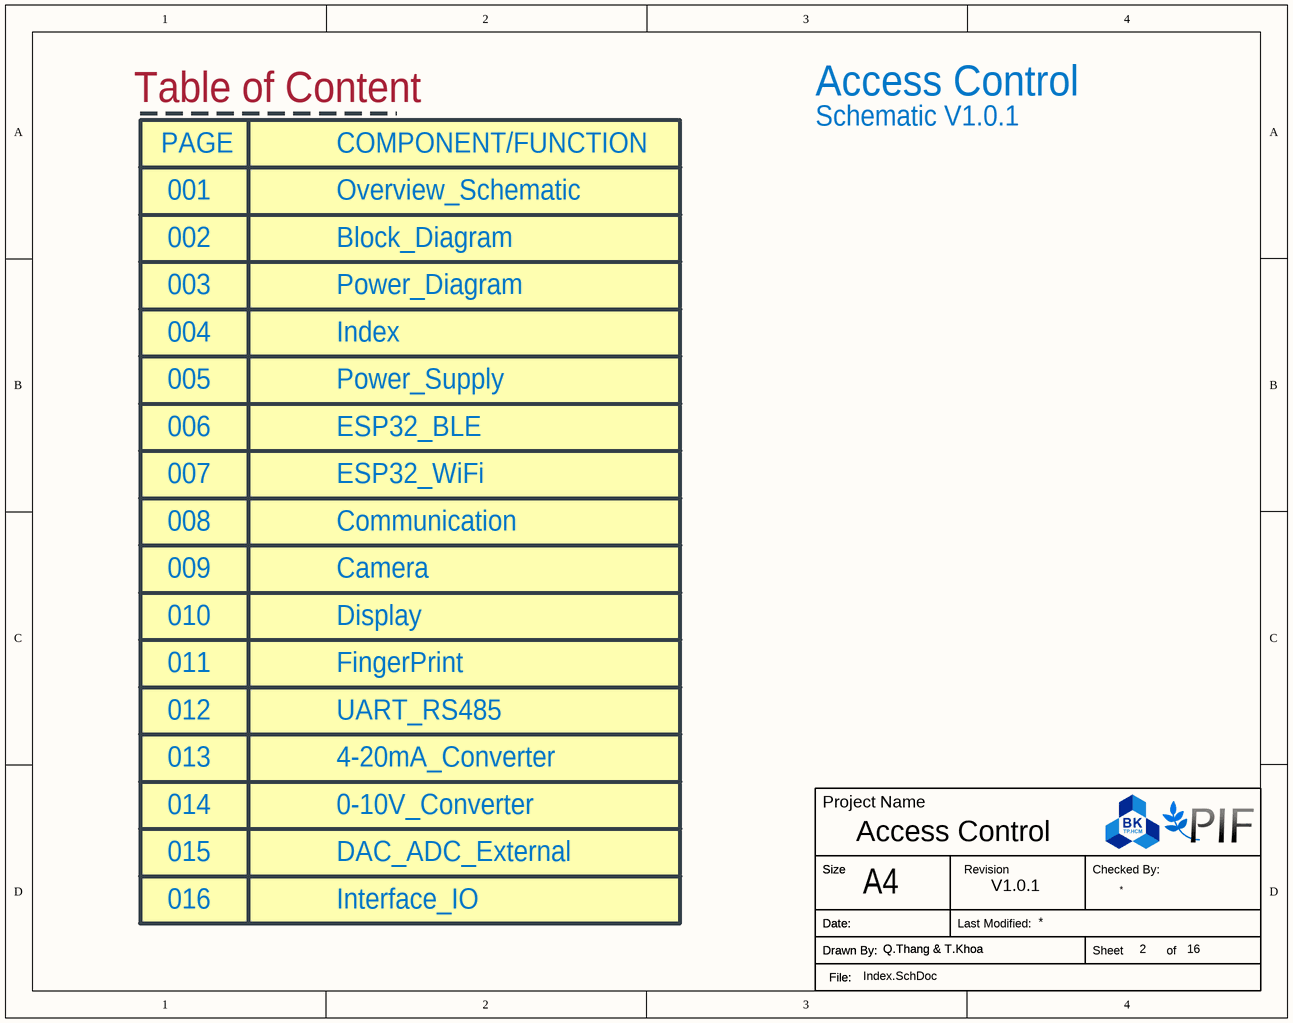
[diagram p13: Index.SchDoc]

### Notes on the sheet
- Access Control
- Table of Content
- PAGE
- COMPONENT/FUNCTION
- Schematic V1.0.1
- 001
- Overview_Schematic
- 002
- 003
- Block_Diagram
- Power_Diagram
- 004
- Index
- 005
- Power_Supply
- 006
- 007
- ESP32_BLE
- ESP32_WiFi
- 008
- Communication
- 009
- 010
- Camera
- Display
- 011
- FingerPrint
- 012
- 013
- UART_RS485
- 4-20mA_Converter
- 014
- 0-10V_Converter
- 015
- 016
- DAC_ADC_External
- Interface_IO
- Project Name
- Size
- A4
- Revision
- Checked By:
- Drawn By:
- Date:
- File:
- Last Modified:
- Sheet
- of

## Sheet Power_Diagram.SchDoc: Access Control
size A3; DrawnBy: Q.Thang & T.Khoa; Revision: V1.0.1; SheetNumber: 3; SheetTotal: 16

### Notes on the sheet
- Project Name
- Size
- A3
- Revision
- Checked By:
- Drawn By:
- Date:
- File:
- Last Modified:
- Sheet
- of
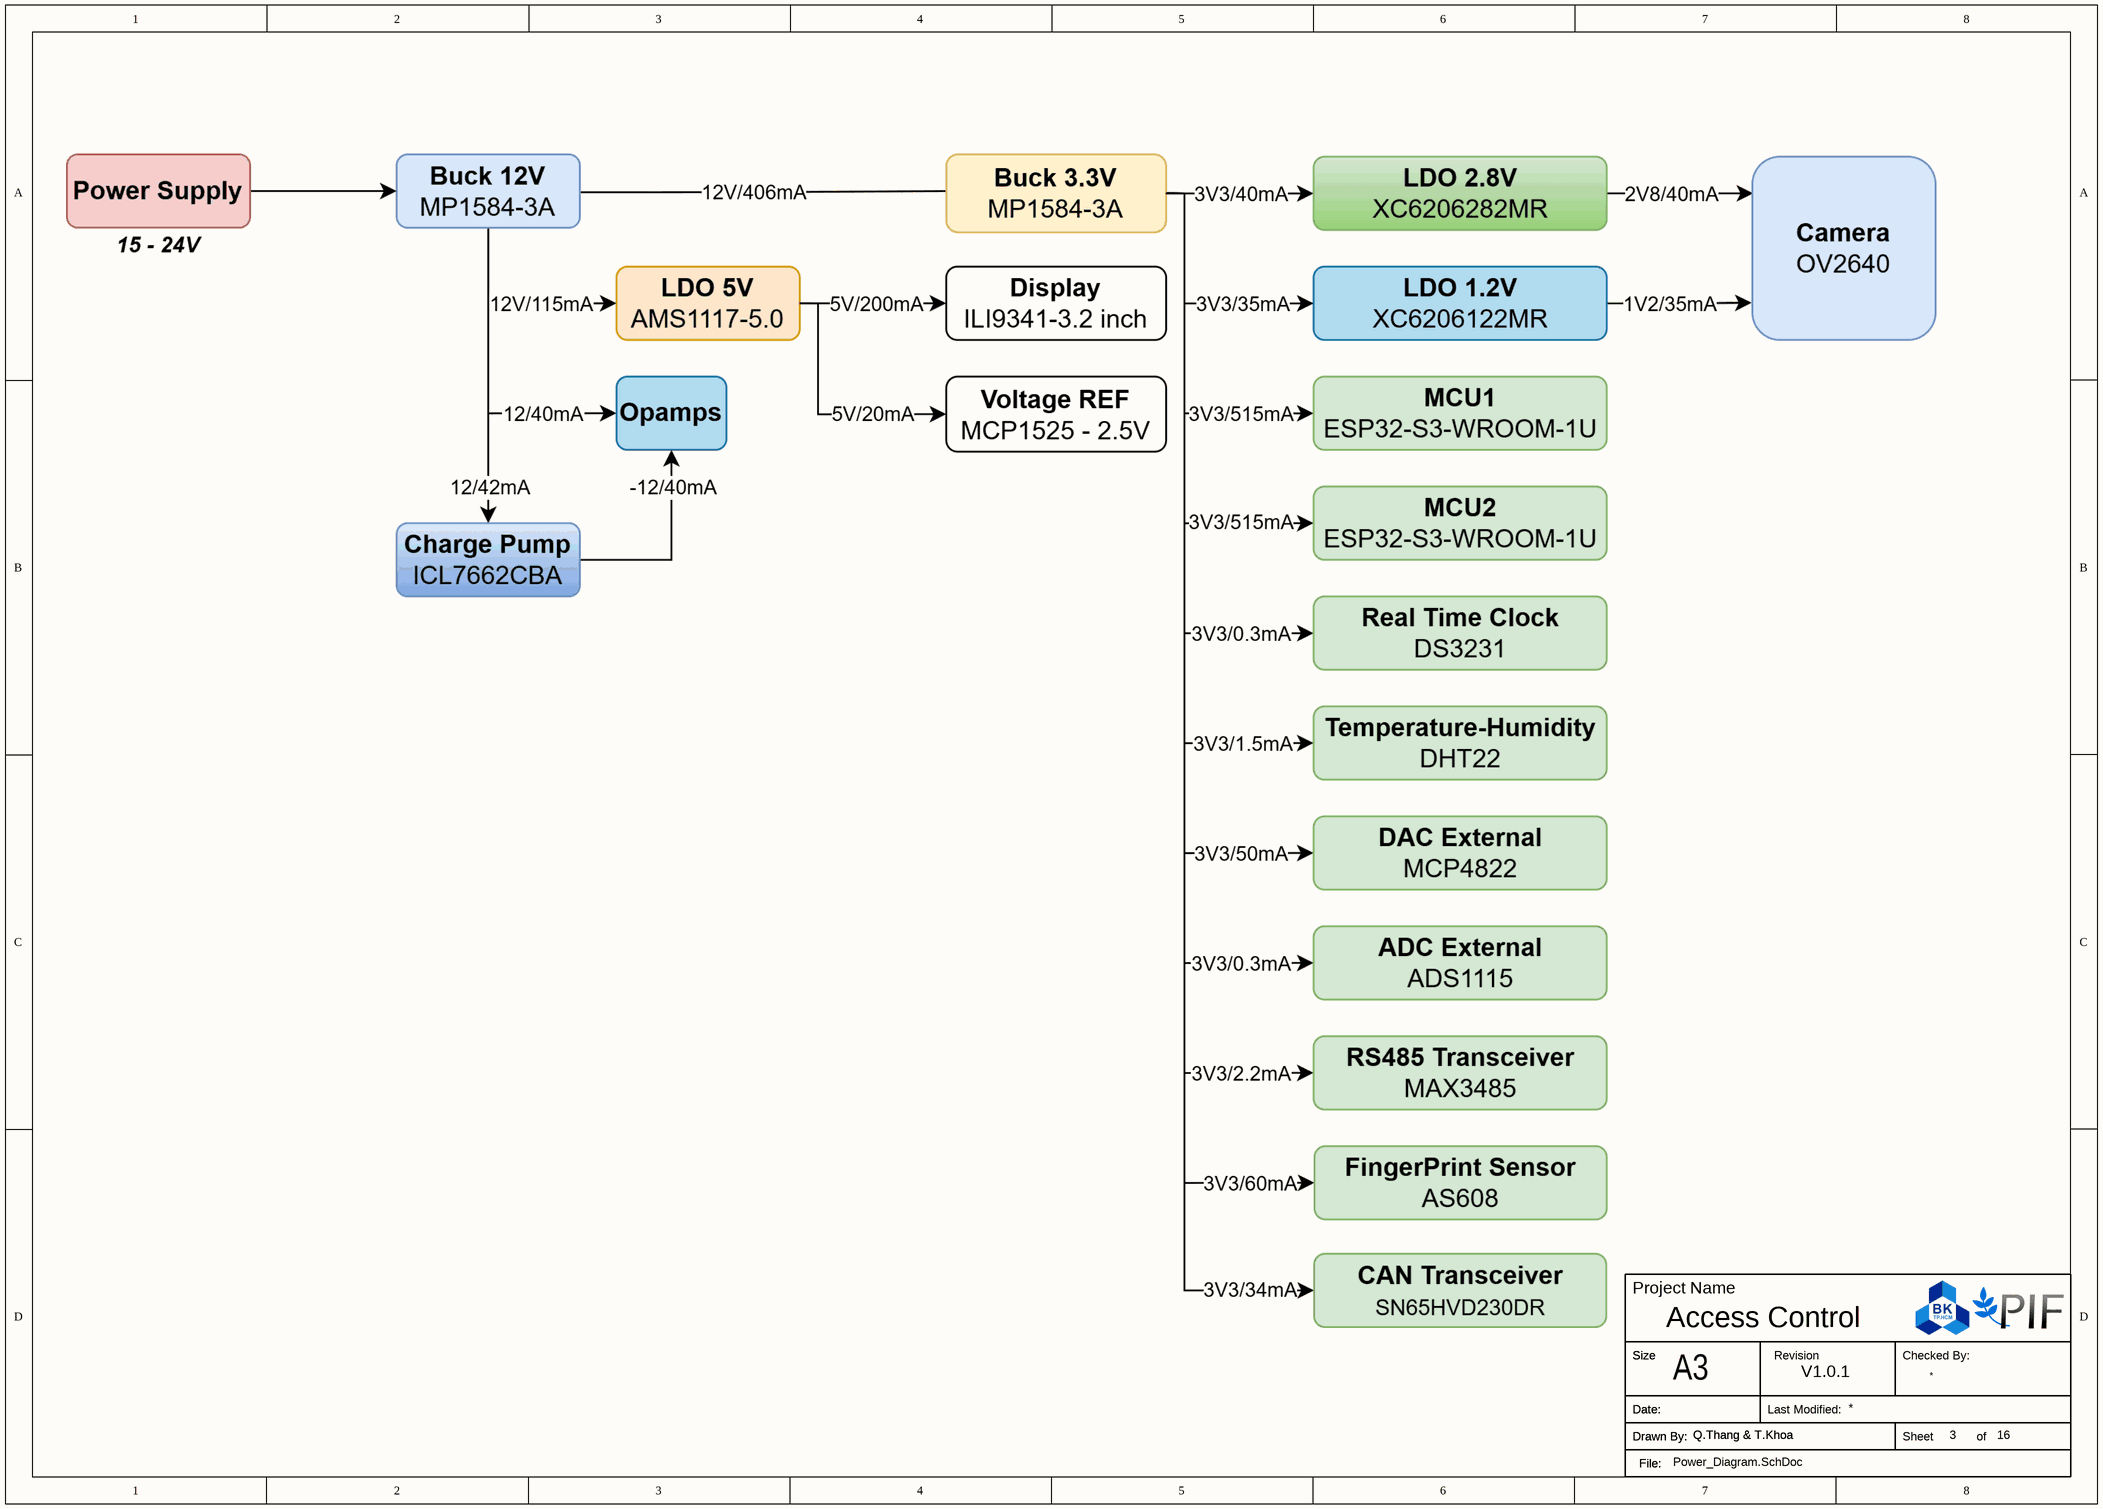
[diagram p14: Power_Diagram.SchDoc]

## Sheet Communication.SchDoc: Access Control
size A; DrawnBy: Q.Thang & T.Khoa; Revision: V1.0.1; SheetNumber: 8; SheetTotal: 16
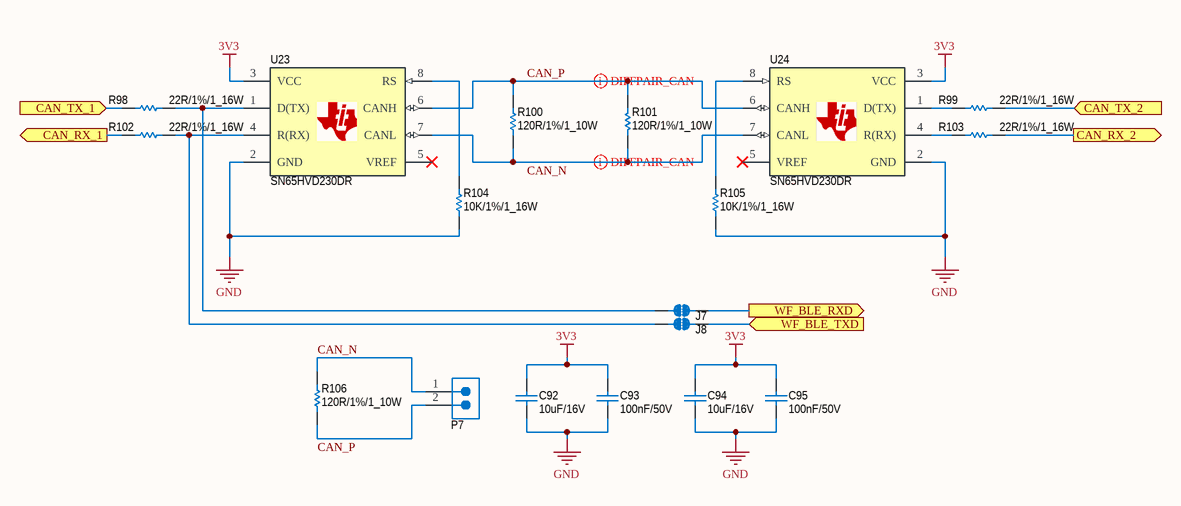
[diagram p15: Communication.SchDoc]

### Parts
C92  10uF/16V  [CAP_0603]
C93  100nF/50V  [CAP_0603]
C94  10uF/16V  [CAP_0603]
C95  100nF/50V  [CAP_0603]
J7  Jumper_Open  [SolderBridgeOpen]  (value not drawn)
J8  Jumper_Open  [SolderBridgeOpen]  (value not drawn)
P7  3.81mm_2P  [Terminal_Block_3.81mm_2P]  (value not drawn)
R98  22R/1%/1_16W  [RESISTOR_0402]
R99  22R/1%/1_16W  [RESISTOR_0402]
R100  120R/1%/1_10W  [Resistor_0603]
R101  120R/1%/1_10W  [Resistor_0603]
R102  22R/1%/1_16W  [RESISTOR_0402]
R103  22R/1%/1_16W  [RESISTOR_0402]
R104  10K/1%/1_16W  [RESISTOR_0402]
R105  10K/1%/1_16W  [RESISTOR_0402]
R106  120R/1%/1_10W  [Resistor_0603]
U23  SN65HVD230DR  [SOIC-8]
U24  SN65HVD230DR  [SOIC-8]

### Ports
CAN_RX_1 (out, see Overview_Schematic[4B]), CAN_RX_2 (out, see Overview_Schematic[5B]), CAN_TX_1 (in, see Overview_Schematic[4B]), CAN_TX_2 (in, see Overview_Schematic[5B]), WF_BLE_RXD (out, see Overview_Schematic[5B], ESP32_WiFi[4B]), WF_BLE_TXD (in, see Overview_Schematic[5B], ESP32_WiFi[4B])

### Nets
3V3: C92.2 C93.2 C94.2 C95.2 U23.3(VCC) U24.3(VCC)
GND: C92.1 C93.1 C94.1 C95.1 R104.2 R105.2 U23.2(GND) U24.2(GND)
CAN_N: P7.1 R100.1 R101.2 R106.2 U23.7(CANL) U24.7(CANL)
CAN_P: P7.2 R100.2 R101.1 R106.1 U23.6(CANH) U24.6(CANH)
NetJ7_1: J7.1 R98.2 U23.1(D(TX))
NetJ7_2: J7.2 R103.2 ; port CAN_RX_2, port WF_BLE_RXD
NetJ8_1: J8.1 R102.2 U23.4(R(RX))
NetJ8_2: J8.2 R99.2 ; port CAN_TX_2, port WF_BLE_TXD
NetR98_1: R98.1 ; port CAN_TX_1
NetR99_1: R99.1 U24.1(D(TX))
NetR102_1: R102.1 ; port CAN_RX_1
NetR103_1: R103.1 U24.4(R(RX))
NetR104_1: R104.1 U23.8(RS)
NetR105_1: R105.1 U24.8(RS)

Not connected (* = marked no-connect by the designer): U23 5(VREF)*; U24 5(VREF)*

### Layout directives
differential pair: CAN_N, CAN_P

### Notes on the sheet
- Project Name
- Size
- A4
- Revision
- Checked By:
- Drawn By:
- Date:
- File:
- Last Modified:
- Sheet
- of

### Library data of the parts
C92 C94 = Ceramic_Cap_10uF_16V_0603: as C86 on sheet Interface_IO; Datasheet: *; Supply URL: https://www.thegioiic.com/tu-gom-0603-10uf-16v
C93 C95 = Ceramic_Cap_100nF_50V_0603: as C87 on sheet Interface_IO; Datasheet: *; Supply URL: https://www.thegioiic.com/tu-gom-0603-100nf-0-1uf-50v
P7 = Terminal_Block_3.81mm_2P: Terminal Block THT, pitch 3.81mm, 2p, 300V, 10A; Supply Part Number: UL-3.81-2-R Terminal Block Plug-in Hàn PCB 2 Chân Cong 3.81mm 300V 10A ULO; Supply Name: Thegioiic; Supply URL: https://www.thegioiic.com/ul-3-81-2-r-terminal-block-plug-in-han-pcb-2-chan-cong-3-81mm-300v-10a-ulo
R98 R99 R102 R103 = Res_22R_0402_1%: Resistor 0402 22 Ohm 1% 1_16W; Supply Name: *; Supply Part Number: *; Supply URL: *
R100 R101 R106 = Res_120R_0603_1%: Resistor 0603 120 Ohm 1% 1_10W; Supply Part Number: Điện Trở 120 Ohm 0603 1%; Supply Name: Thegioiic; Supply URL: https://www.thegioiic.com/dien-tro-120-ohm-0603-1-
R104 R105 = Res_10K_0402_1%: as R84-R86 on sheet Interface_IO; Supply URL: https://www.thegioiic.com/dien-tro-10-kohm-0402-1-
U23 U24 = SN65HVD230DR: 1/1 Transceiver Half CANbus; Supply Part Number: SN65HVD230DR CAN Transceiver 8-SOIC; Supply Name: Thegioiic; Datasheet: https://www.ti.com/lit/ds/symlink/sn65hvd230.pdf; Supply URL: https://www.thegioiic.com/sn65hvd230dr-can-transceiver-8-soic
J7 J8 = Jumper_Open: Datasheet: *; Supply Name: *; Supply Part Number: *; Supply URL: *

## Nets that join several sheets
1V2: Power_Supply (C22.2 C23.2 U4.2), Camera (C39.2 J3.10)
2V8: Power_Supply (C18.2 C19.2 U3.2), Camera (C40.2 J3.4)
3V3: ESP32_BLE (5 pins), ESP32_WiFi (6 pins), Power_Supply (12 pins), DAC_ADC_External (6 pins), 4-20mA_Converter (D11.C), 0-10V_Converter (D13.C), UART_RS485 (C46.2 C47.2 R45.2 U9.8), Camera (C41.2 J3.11 R31.2 R32.2), Display (FB4.1 R33.2 R34.2 R37.2), Interface_IO (11 pins), FingerPrint (5 pins), Communication (6 pins)
5V: Power_Supply (6 pins), 4-20mA_Converter (C53.2 C54.2 U10.1), Display (C42.2 C43.2 LCD1.1)
12V: Power_Supply (15 pins), 4-20mA_Converter (10 pins), 0-10V_Converter (6 pins), Interface_IO (8 pins)
-12V: Power_Supply (C28.2 D4.C TP8.1 U5.5), 4-20mA_Converter (U11.4 U12.4 U13.4), 0-10V_Converter (U14.4 U15.4)
GND: ESP32_BLE (21 pins), ESP32_WiFi (23 pins), Power_Supply (54 pins), DAC_ADC_External (8 pins), 4-20mA_Converter (26 pins), 0-10V_Converter (17 pins), UART_RS485 (C46.1 C47.1 R51.2 U9.5), Camera (7 pins), Display (5 pins), Interface_IO (23 pins), FingerPrint (5 pins), Communication (8 pins)
NetD11_A: DAC_ADC_External (U16.5), 4-20mA_Converter (5 pins)
NetD13_A: DAC_ADC_External (U16.4), 0-10V_Converter (5 pins)
NetJ3_3: ESP32_BLE (U7.15), Camera (J3.3 R31.1)
NetJ3_5: ESP32_BLE (U7.14), Camera (J3.5 R32.1)
NetJ3_7: ESP32_BLE (U7.12), Camera (J3.7)
NetJ3_9: ESP32_BLE (U7.11), Camera (J3.9)
NetJ3_12: ESP32_BLE (U7.17), Camera (J3.12)
NetJ3_13: ESP32_BLE (U7.18), Camera (J3.13)
NetJ3_14: ESP32_BLE (U7.19), Camera (J3.14)
NetJ3_16: ESP32_BLE (U7.20), Camera (J3.16)
NetJ3_17: ESP32_BLE (U7.21), Camera (J3.17)
NetJ3_18: ESP32_BLE (U7.10), Camera (J3.18)
NetJ3_19: ESP32_BLE (U7.9), Camera (J3.19)
NetJ3_20: ESP32_BLE (U7.8), Camera (J3.20)
NetJ3_21: ESP32_BLE (U7.7), Camera (J3.21)
NetJ3_22: ESP32_BLE (U7.6), Camera (J3.22)
NetJ5_2: ESP32_WiFi (U8.17), Interface_IO (J5.2 R95.1)
NetJ7_2: ESP32_WiFi (U8.34), Communication (J7.2 R103.2)
NetJ8_2: ESP32_WiFi (U8.35), Communication (J8.2 R99.2)
NetLCD1_3: ESP32_BLE (R20.2 U7.16), Display (LCD1.3 R34.1)
NetLCD1_4: ESP32_BLE (U7.5), Display (LCD1.4)
NetLCD1_5: ESP32_BLE (U7.32), Display (LCD1.5)
NetLCD1_6: ESP32_BLE (U7.24), Display (LCD1.6)
NetLCD1_11: ESP32_BLE (U7.34), Display (LCD1.11 R33.1)
NetLCD1_12: ESP32_BLE (U7.31), Display (LCD1.12)
NetLCD1_13: ESP32_BLE (U7.33), Display (LCD1.13)
NetLCD1_14: ESP32_BLE (U7.35), Display (LCD1.14)
NetLCD1_15: ESP32_WiFi (U8.25), Display (LCD1.15 R37.1)
NetLCD1_16: ESP32_WiFi (U8.21), DAC_ADC_External (U17.4), Display (LCD1.16)
NetLCD1_17: ESP32_WiFi (U8.19), Display (LCD1.17)
NetQ1_1: ESP32_BLE (U7.13), Display (Q1.1 R40.2)
NetR19_2: ESP32_BLE (R19.2 U7.26), Display (R36.1)
NetR35_1: ESP32_BLE (U7.25), Display (R35.1)
NetR38_1: ESP32_WiFi (U8.20), DAC_ADC_External (R80.1), Display (R38.1)
NetR43_1: ESP32_WiFi (U8.9), FingerPrint (R43.1)
NetR44_1: ESP32_WiFi (U8.8), FingerPrint (R44.1)
NetR46_1: ESP32_WiFi (U8.11), UART_RS485 (R46.1)
NetR47_1: ESP32_WiFi (U8.24), UART_RS485 (R47.1)
NetR49_1: ESP32_WiFi (U8.23), UART_RS485 (R49.1)
NetR50_1: ESP32_WiFi (U8.10), UART_RS485 (R50.1)
NetR56_1: DAC_ADC_External (U17.8), 4-20mA_Converter (R56.1)
NetR74_1: DAC_ADC_External (U17.6), 0-10V_Converter (R74.1 TP16.1)
NetR77_1: ESP32_WiFi (U8.31), DAC_ADC_External (R77.1 U16.2)
NetR78_1: ESP32_WiFi (U8.22), DAC_ADC_External (R78.1 U17.2)
NetR79_1: ESP32_WiFi (U8.18), DAC_ADC_External (R79.1 U17.5)
NetR82_1: ESP32_WiFi (U8.5), Interface_IO (R82.1)
NetR84_2: ESP32_WiFi (U8.6), Interface_IO (R84.2 U18.3)
NetR88_2: ESP32_WiFi (U8.7), Interface_IO (R88.2 U20.3)
NetR91_1: ESP32_WiFi (U8.4), Interface_IO (R91.1)
NetR96_1: ESP32_WiFi (U8.33), DAC_ADC_External (U16.10), Interface_IO (R96.1 U22.16)
NetR97_1: ESP32_WiFi (U8.32), DAC_ADC_External (U16.9), Interface_IO (R97.1 U22.15)
NetR98_1: ESP32_BLE (U7.23), Communication (R98.1)
NetR102_1: ESP32_BLE (U7.22), Communication (R102.1)
Vref_0.75V: DAC_ADC_External (D15.A D16.C U16.6), 4-20mA_Converter (R57.1 TP9.1 U11.6 U11.7)